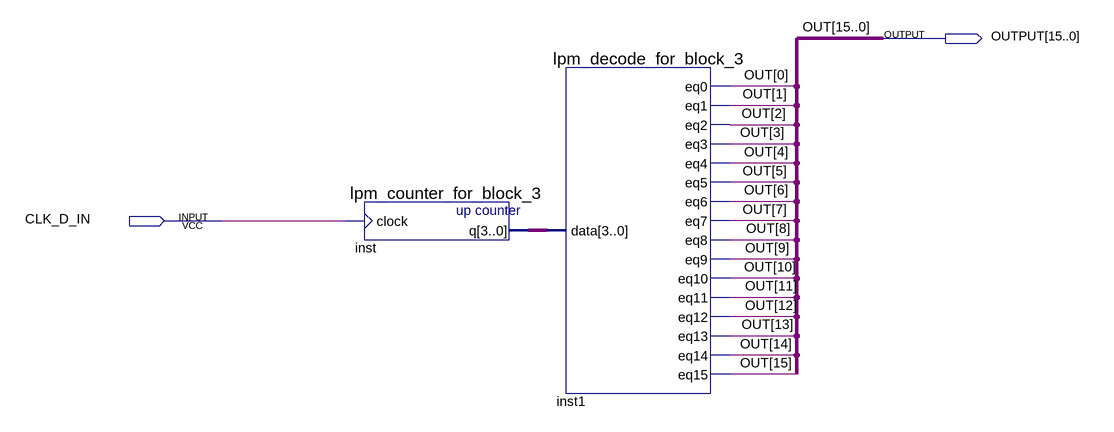
[diagram p0: schematic sheet]
// Quartus schematic Blcok3.bdf as structural Verilog: 2 symbols, 2 pins
module Blcok3 (
  input  CLK_D_IN,
  output [15:0] OUTPUT
);

  wire [3:0] inst_q;

  lpm_counter_for_block_3 inst (.clock(CLK_D_IN), .q(inst_q));
  lpm_decode_for_block_3 inst1 (
    .data(inst_q), .eq0(OUTPUT[0]), .eq1(OUTPUT[1]), .eq2(OUTPUT[2]), .eq3(OUTPUT[3]), .eq4(OUTPUT[4]),
    .eq5(OUTPUT[5]), .eq6(OUTPUT[6]), .eq7(OUTPUT[7]), .eq8(OUTPUT[8]), .eq9(OUTPUT[9]), .eq10(OUTPUT[10]),
    .eq11(OUTPUT[11]), .eq12(OUTPUT[12]), .eq13(OUTPUT[13]), .eq14(OUTPUT[14]), .eq15(OUTPUT[15]));

  // Other names for the same wires on the sheet: OUT[15:0] = OUTPUT
endmodule
